# Altium project Purple_Pill.PrjPcb
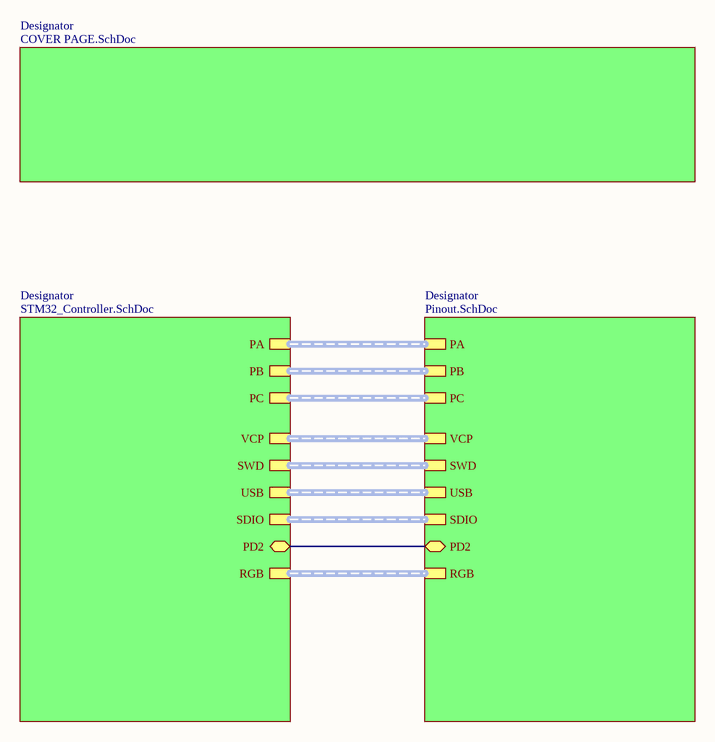
[diagram p0: Purple_Pill.SchDoc]
4 sheets, 64 parts. Net scope: hierarchical (ports join the sheet entries above them; power ports are global).
Board file: Purple_Pill.PcbDoc
Sheets:
  Purple_Pill.SchDoc
    Designator = STM32_Controller.SchDoc
    Designator = Pinout.SchDoc
    Designator = COVER PAGE.SchDoc

## Sheet Purple_Pill.SchDoc: =DocumentName
size 393 x 281 mm; Date: Do not fill; ApprovedBy: Do not fill; CheckedBy: Do not fill; CompanyName: STAR; DrawnBy: Do not fill; Engineer: Do not fill; Organization: STAR; Address1: Avenida Peseta 68, 1ºB; Address2: Madrid, Madrid 28054; Address3: +34603739927; Address4: contact.star@uc3m.es; DocumentNumber: Do not fill; SheetNumber: 1; SheetTotal: 4; Project Name: Purple Pill; Sheet Name: Purple Pill; Time: Do not fill; ImagePath: Do not fill; Application_BuildNumber: Do not fill

### Sub-sheets
Designator = STM32_Controller.SchDoc: PA (harness GPIO1), PB (harness GPIO2), PC (harness GPIO3), VCP (harness VCP), SWD (harness SWD), USB (harness USB), SDIO (harness SDIO), PD2 (bidir), RGB (harness RGB)
Designator = Pinout.SchDoc: PA (harness GPIO1), PB (harness GPIO2), PC (harness GPIO3), VCP (harness VCP), SWD (harness SWD), USB (harness USB), SDIO (harness SDIO), PD2 (bidir), RGB (harness RGB)
Designator = COVER PAGE.SchDoc: no entries

### Nets
PD2: sheet Designator/PD2, sheet Designator/PD2

### Notes on the sheet
- SHEET NAME
- FILE NAME
- A3
- SIZE
- PROJECT NAME
- AUTHOR
- SHEET
- OF
- REV

## Sheet STM32_Controller.SchDoc: =DocumentName
size 393 x 281 mm; Date: Do not fill; ApprovedBy: Do not fill; CheckedBy: Do not fill; CompanyName: STAR; DrawnBy: Do not fill; Engineer: Do not fill; Organization: STAR; Address1: Avenida Peseta 68, 1ºB; Address2: Madrid, Madrid 28054; Address3: +34603739927; Address4: contact.star@uc3m.es; DocumentNumber: Do not fill; SheetNumber: 3; SheetTotal: 4; Project Name: Purple Pill; Sheet Name: STM32 Controller; Time: Do not fill; ImagePath: Do not fill; Application_BuildNumber: Do not fill
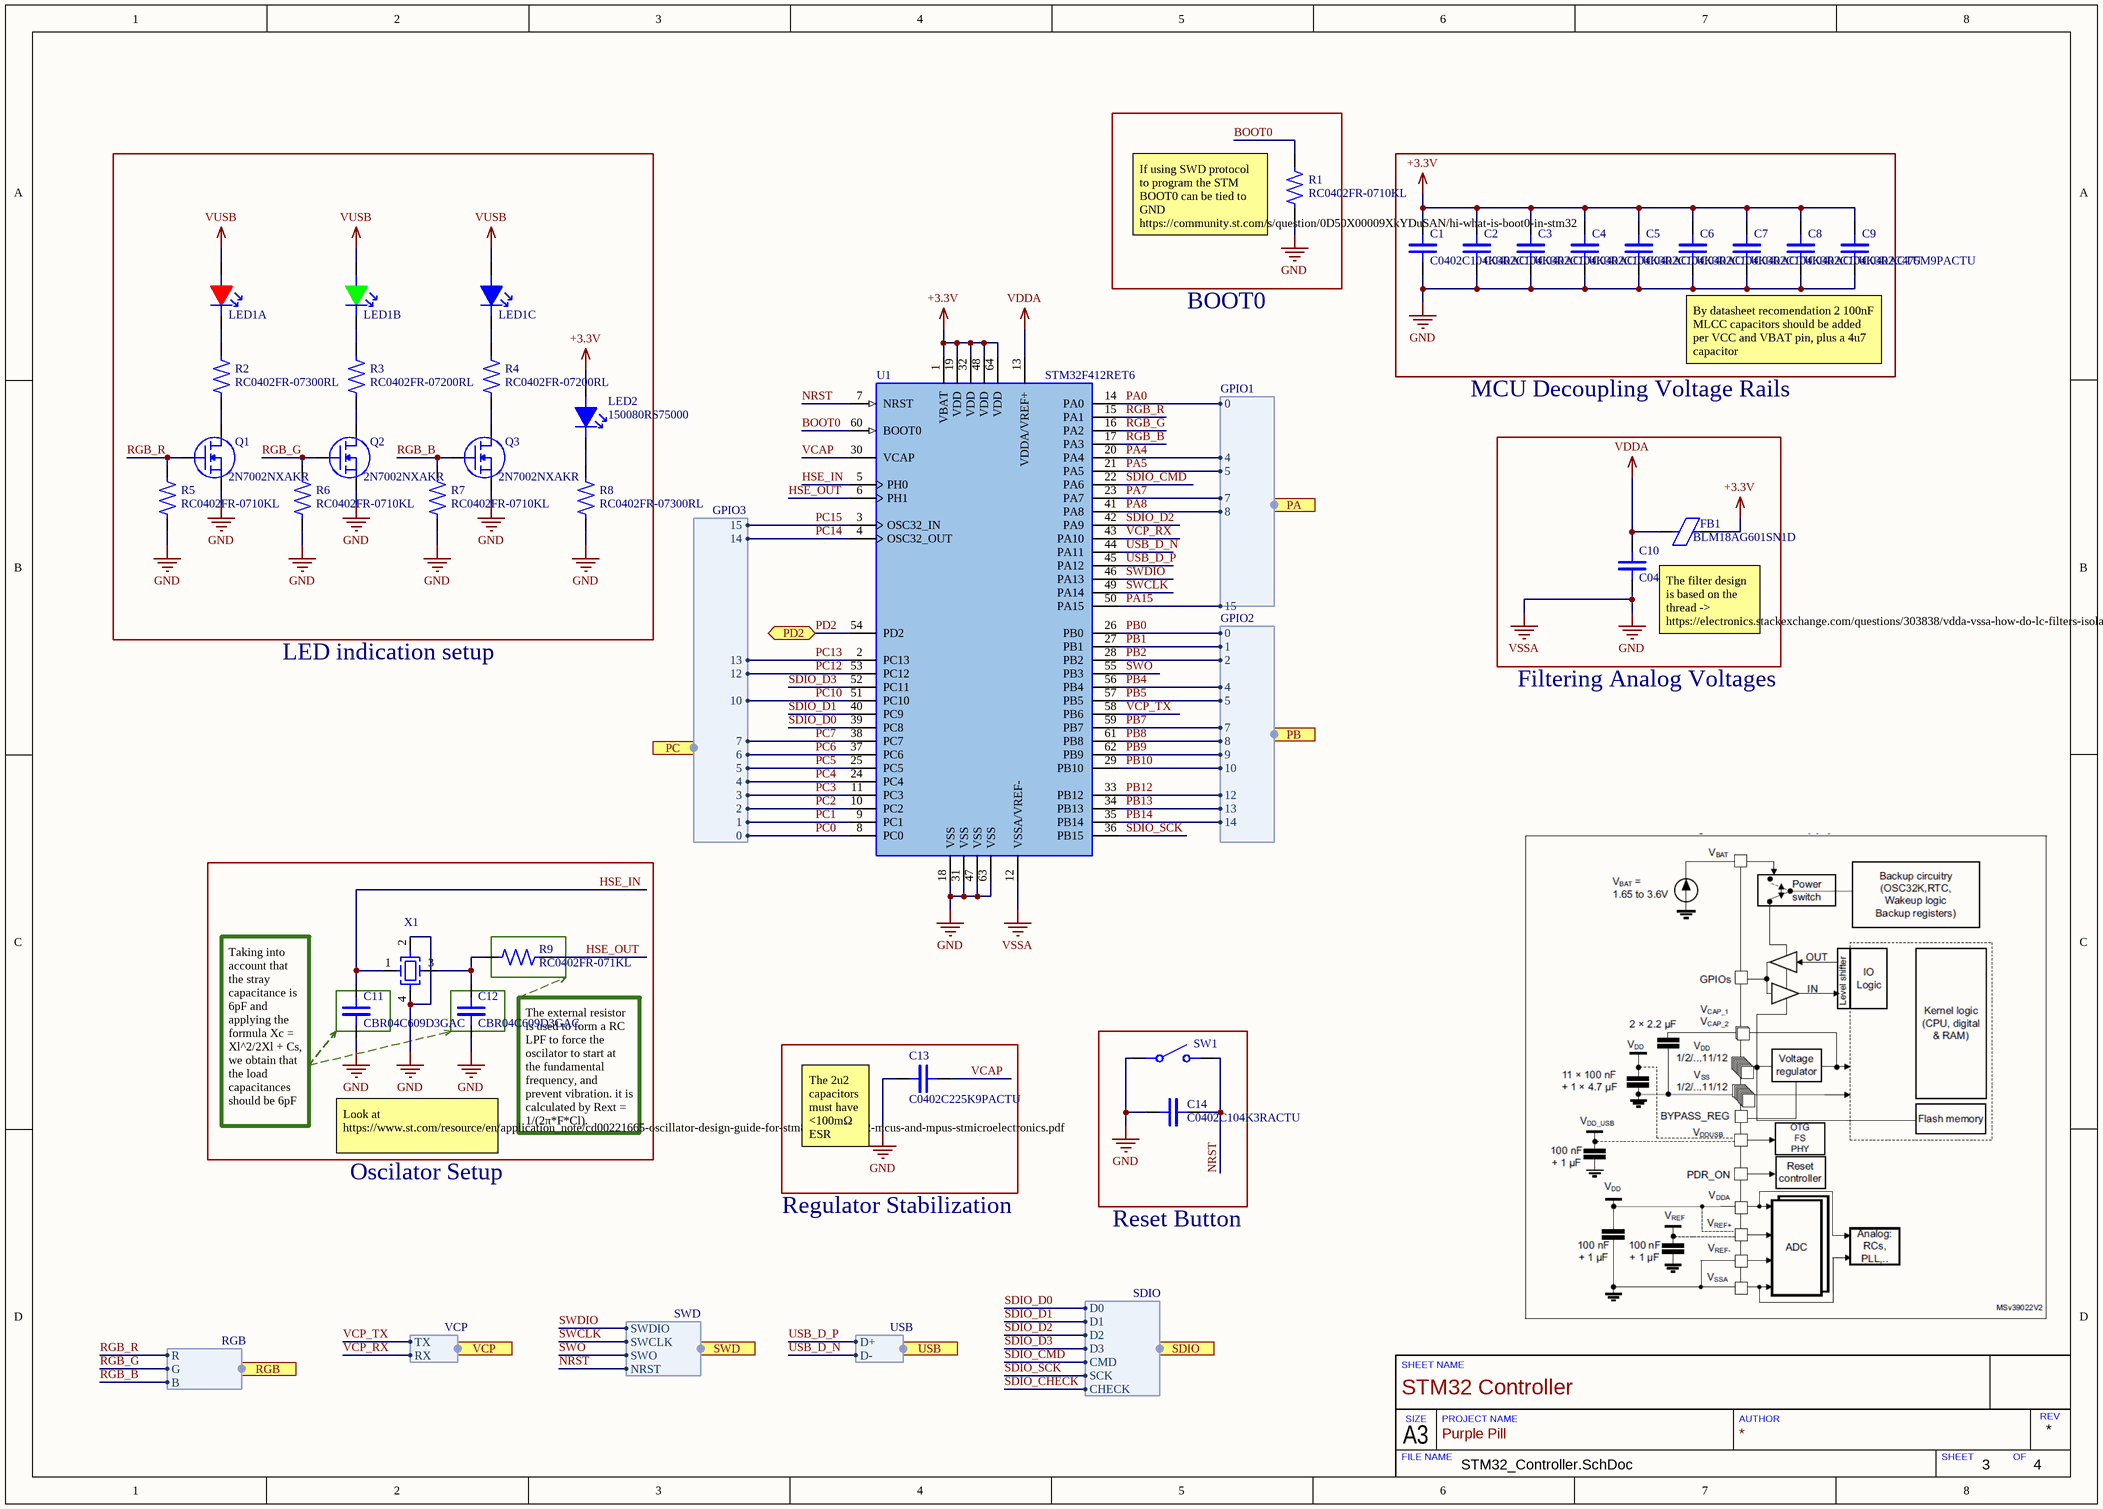
[diagram p1: STM32_Controller.SchDoc]

### Parts
C1  C0402C104K3RACTU  [CM0402_KEMET]
C2  C0402C104K3RACTU  [CM0402_KEMET]
C3  C0402C104K3RACTU  [CM0402_KEMET]
C4  C0402C104K3RACTU  [CM0402_KEMET]
C5  C0402C104K3RACTU  [CM0402_KEMET]
C6  C0402C104K3RACTU  [CM0402_KEMET]
C7  C0402C104K3RACTU  [CM0402_KEMET]
C8  C0402C104K3RACTU  [CM0402_KEMET]
C9  C0402C475M9PACTU  [CM0402_KEMET]
C10  C0402C104K3RACTU  [CM0402_KEMET]
C11  CBR04C609D3GAC  [CM0402_KEMET]
C12  CBR04C609D3GAC  [CM0402_KEMET]
C13  C0402C225K9PACTU  [CM0402_KEMET]
C14  C0402C104K3RACTU  [CM0402_KEMET]
FB1  BLM18AG601SN1D  [FB0603_MURATA]
LED1  TC5050RGBF08-3CJH-AF53A  [LED_RGB_5050]  (value not drawn)  (parts A,B,C of 3)
LED2  150080RS75000  [LED0805_WURTH]
Q1  2N7002NXAKR  [SOT23-3]
Q2  2N7002NXAKR  [SOT23-3]
Q3  2N7002NXAKR  [SOT23-3]
R1  RC0402FR-0710KL  [R0402_YAGEO]
R2  RC0402FR-07300RL  [R0402_YAGEO]
R3  RC0402FR-07200RL  [R0402_YAGEO]
R4  RC0402FR-07200RL  [R0402_YAGEO]
R5  RC0402FR-0710KL  [R0402_YAGEO]
R6  RC0402FR-0710KL  [R0402_YAGEO]
R7  RC0402FR-0710KL  [R0402_YAGEO]
R8  RC0402FR-07300RL  [R0402_YAGEO]
R9  RC0402FR-071KL  [R0402_YAGEO]
SW1  Push button SPST small  [1TS002E-2400-2500-CT]  (value not drawn)
U1  STM32F412RET6  [LQFP64]
X1  CR24MHz  [XTAL_3.2x2.4]  (value not drawn)

### Ports
PA (harness GPIO1), PB (harness GPIO2), PC (harness GPIO3), PD2 (bidir), RGB (harness RGB), SDIO (harness SDIO), SWD (harness SWD), USB (harness USB), VCP (harness VCP)

### Harnesses
GPIO2: 0, 5, 7, 8, 10, 12, 1, 13, 14, 2, 9, 4
GPIO1: 4, 8, 15, 5, 7, 0
GPIO3: 10, 7, 6, 5, 4, 3, 1, 0, 2, 12, 13, 15, 14
SWD: SWDIO, SWCLK, SWO, NRST
VCP: TX, RX
USB: D+, D-
SDIO: D3, CMD, SCK, CHECK, D2, D1, D0
RGB: R, G, B

### Nets
+3.3V: C1.2 C2.2 C3.2 C4.2 C5.2 C6.2 C7.2 C8.2 C9.2 FB1.2 LED2.2(Anode) U1.1(VBAT) U1.19(VDD) U1.32(VDD) U1.48(VDD) U1.64(VDD)
GND: C1.1 C2.1 C3.1 C4.1 C5.1 C6.1 C7.1 C8.1 C9.1 C10.1 C11.1 C12.1 C13.2 C14.1 Q1.3(Source) Q2.3(Source) Q3.3(Source) R1.1 R5.1 R6.1 R7.1 R8.1 SW1.2 U1.12(VSSA/VREF-) U1.18(VSS) U1.31(VSS) U1.47(VSS) U1.63(VSS) X1.2(Ground) X1.4(Ground)  [also labelled VSSA]
VDDA: C10.2 FB1.1 U1.13(VDDA/VREF+)
VUSB: LED1.1(Anode1) LED1.3(Anode2) LED1.5(Anode3)
BOOT0: R1.2 U1.60(BOOT0)
HSE_IN: C11.2 U1.5(PH0) X1.1(XTAL1)
HSE_OUT: R9.2 U1.6(PH1)
NRST: C14.2 SW1.1 U1.7(NRST) ; port SWD.NRST
PA0: U1.14(PA0) ; port PA.0
PA4: U1.20(PA4) ; port PA.4
PA5: U1.21(PA5) ; port PA.5
PA7: U1.23(PA7) ; port PA.7
PA8: U1.41(PA8) ; port PA.8
PA15: U1.50(PA15) ; port PA.15
PB0: U1.26(PB0) ; port PB.0
PB1: U1.27(PB1) ; port PB.1
PB2: U1.28(PB2) ; port PB.2
PB4: U1.56(PB4) ; port PB.4
PB5: U1.57(PB5) ; port PB.5
PB7: U1.59(PB7) ; port PB.7
PB8: U1.61(PB8) ; port PB.8
PB9: U1.62(PB9) ; port PB.9
PB10: U1.29(PB10) ; port PB.10
PB12: U1.33(PB12) ; port PB.12
PB13: U1.34(PB13) ; port PB.13
PB14: U1.35(PB14) ; port PB.14
PC0: U1.8(PC0) ; port PC.0
PC1: U1.9(PC1) ; port PC.1
PC2: U1.10(PC2) ; port PC.2
PC3: U1.11(PC3) ; port PC.3
PC4: U1.24(PC4) ; port PC.4
PC5: U1.25(PC5) ; port PC.5
PC6: U1.37(PC6) ; port PC.6
PC7: U1.38(PC7) ; port PC.7
PC10: U1.51(PC10) ; port PC.10
PC12: U1.53(PC12) ; port PC.12
PC13: U1.2(PC13) ; port PC.13
PC14: U1.4(OSC32_OUT) ; port PC.14
PC15: U1.3(OSC32_IN) ; port PC.15
PD2: U1.54(PD2) ; port PD2
RGB_B: Q3.1(Gate) R7.2 U1.17(PA3) ; port RGB.B
RGB_G: Q2.1(Gate) R6.2 U1.16(PA2) ; port RGB.G
RGB_R: Q1.1(Gate) R5.2 U1.15(PA1) ; port RGB.R
SDIO_CMD: U1.22(PA6) ; port SDIO.CMD
SDIO_D0: U1.39(PC8) ; port SDIO.D0
SDIO_D1: U1.40(PC9) ; port SDIO.D1
SDIO_D2: U1.42(PA9) ; port SDIO.D2
SDIO_D3: U1.52(PC11) ; port SDIO.D3
SDIO_SCK: U1.36(PB15) ; port SDIO.SCK
SWCLK: U1.49(PA14) ; port SWD.SWCLK
SWDIO: U1.46(PA13) ; port SWD.SWDIO
SWO: U1.55(PB3) ; port SWD.SWO
USB_D_N: U1.44(PA11) ; port USB.D-
USB_D_P: U1.45(PA12) ; port USB.D+
VCAP: C13.1 U1.30(VCAP)
VCP_RX: U1.43(PA10) ; port VCP.RX
VCP_TX: U1.58(PB6) ; port VCP.TX
NetC12_2: C12.2 R9.1 X1.3(XTAL2)
NetLED1_2: LED1.2(Cathode1) R2.2
NetLED1_4: LED1.4(Cathode2) R3.2
NetLED1_6: LED1.6(Cathode3) R4.2
NetLED2_1: LED2.1(Cathode) R8.2
NetQ1_2: Q1.2(Drain) R2.1
NetQ2_2: Q2.2(Drain) R3.1
NetQ3_2: Q3.2(Drain) R4.1

### Notes on the sheet
- (near R1) If using SWD protocol to program the STM BOOT0 can be tied to GND https://community.st.com/s/question/0D50X00009XkYDuSAN/hi-what-is-boot0-in-stm32
- BOOT0
- By datasheet recomendation 2 100nF MLCC capacitors should be added per VCC and VBAT pin, plus a 4u7 capacitor
- MCU Decoupling Voltage Rails
- The filter design is based on the thread -> https://electronics.stackexchange.com/questions/303838/vdda-vssa-how-do-lc-filters-isolate-the-input-pins-to-minimize-error-and-noi
- LED indication setup
- Filtering Analog Voltages
- Taking into account that the stray capacitance is 6pF and applying the formula Xc = Xl^2/2Xl + Cs, we obtain that the load capacitances should be 6pF
- The external resistor is used to form a RC LPF to force the oscilator to start at the fundamental frequency, and prevent vibration. it is calculated by Rext = 1/(2π*F*Cl).
- Look at https://www.st.com/resource/en/application_note/cd00221665-oscillator-design-guide-for-stm8af-al-s-stm32-mcus-and-mpus-stmicroelectronics.pdf
- Oscilator Setup
- (near C13) The 2u2 capacitors must have <100mΩ ESR
- Regulator Stabilization
- Reset Button
- RGB LED analog voltages
- Virtual COM port through ST-LINK
- SWD comunication protocol for debug and program
- USB D+ & D- differential signal
- Secure Digital Input Output, interface for SD cards
- SHEET NAME
- FILE NAME
- A3
- SIZE
- PROJECT NAME
- AUTHOR
- SHEET
- OF
- REV

### Library data of the parts
C1-C8 C10 C14 = CMP-CAP-002-00024-2: 0.1 µF ±10% 25V Ceramic Capacitor X7R 0402 (1005 Metric; Manufacturer: KEMET; Capacitance: 100nF; Unit weight: 1.5mg; Voltage rating: 25V; Component link: https://octopart.com/c0402c104k3ractu-kemet-71105629?r=sp; Height: 500µm; Mounting type: SMT; Maximun operating temperature: 125°C; Package: 0402; RoHS: Yes; Minimun operating temperature: -55°C; Dielectric: X7R; Tolerance: 10%; LCSC Part#: C1525
C9 = CMP-CAP-002-00026-2: 4.7 µF ±20% 6.3V Ceramic Capacitor X5R 0402 (1005 Metric); Manufacturer: KEMET; Unit weight: 1.5mg; Capacitance: 4.7µF; Tolerance: 10%; Dielectric: X5R; Maximun operating temperature: 85°C; Mounting type: SMT; Component link: https://octopart.com/search?q=C0402C475M9PACTU&currency=USD&specs=0; RoHS: Yes; Voltage rating: 6.3V; Height: 500µm; Package: 0402; Minimun operating temperature: -55°C; LCSC Part#: C368809
C11 C12 = CMP-CAP-002-00027-2: 6 pF ±0.5pF 25V Ceramic Capacitor C0G, NP0 0402 (1005 Metric); Manufacturer: KEMET; Unit weight: 1.5mg; Tolerance: 8.3%; Capacitance: 6pF; RoHS: Yes; Mounting type: SMT; Height: 500µm; Maximun operating temperature: 125°C; Voltage rating: 25V; Component link: https://octopart.com/cbr04c609d3gac-kemet-88381094?r=sp; Package: 0402; Dielectric: C0G; Minimun operating temperature: -55°C; LCSC Part#: C1575
C13 = CMP-CAP-002-00025-2: 2.2 µF ±10% 6.3V Ceramic Capacitor X5R 0402 (1005 Metric); Manufacturer: KEMET; Unit weight: 1.5mg; Capacitance: 2.2µF; Height: 500µm; Voltage rating: 6.3V; Mounting type: SMT; Component link: https://octopart.com/c0402c225k9pactu-kemet-46923142?r=sp; Minimun operating temperature: -55°C; RoHS: Yes; Tolerance: 10%; Maximun operating temperature: 125°C; Dielectric: X5R; Package: 0402; LCSC Part#: C77002
FB1 = CMP-IND-001-00000-2: Ferrite Chip, 1 Function(s), 0.5A, 2 Pin(s); Manufacturer: Murata; Maximun DC resistance: 0.38; Impedance: 600; Unit weight: 35mg; Test frequency: 100MHz; Tolerance: 25%; Maximun DC current: 500mA; RoHs: Yes; Height: 800µm; Maximun operating temperature: 125°C; Component link: https://octopart.com/blm18ag601sn1d-murata-42207?r=sp#PriceAndStock; Package: 0603; Mounting type: SMT; Minimun operating temperature: -55°C; LCSC Part#: C19330
LED1 = CMP-DIOD-001-00006-3: 20mA -40℃~+85℃ RGB 200mW 5050(mm) Light Emitting Diodes (LED) ROHS; pin to pad: 1>2 2>5 3>1 4>6 5>3 6>4; Manufacturer: TCWIN; Forward Voltages: R: 2.2V, G: 3V, B: 3V; Lens transparency: Silicone; MCD ratings: R: 700mcd, G: 1750mcd, B: 500mcd; Viewing angle: 60º; Colors/Wavelegths: R: 622, G: 517, B: 467; Nominal Currents: R: 20mA, G: ~20mA, B: ~20mA; Component link: https://octopart.com/tc5050rgbf08-3cjh-af53a-tcwin-122695383?r=sp; RoHS: Yes; Mounting type: SMT; Maximun operating temperature: 85°C; Package: 5050 (mm); Height: 1.6mm; Minimun operating temperature: -40°C; LCSC Part#: C784540
LED2 = CMP-DIOD-001-00002-3: Red 625nm LED Indication - Discrete 2V 0805 (2012 Metric); Manufacturer: Würth Elektronik; Unit weight: 25mg; Lens transparency: Clear; Viewing angle: 140º; MCD ratings: 150mcd; Nominal Currents: 20mA; Colors/Wavelegths: Red, 625nm; Minimun operating temperature: -40°C; Maximun operating temperature: 85°C; Forward Voltages: 2V; Mounting type: SMT; RoHS: Yes; Package: 0805; Height: 800µm; Component link: https://octopart.com/150080rs75000-w%C3%BCrth+elektronik-29717781?r=sp; LCSC Part#: C5137314
Q1-Q3 = CMP-TRAN-002-00009-3: 2N7002NXAK - 60 V, single N-channel Trench MOSFET; pin to pad: 2>3 3>2; Manufacturer: Nexperia; VoltageGS (th): 1.6V; V (DS) breakdown: 60V; gfs: 500m; Unit weight: 8mg; Channel Type: N; Rds (ON): 3; Power Dissipation: 325mW; I (d) Pulsed: 760mA; I (GS) leakage: 500nA; I (D) Continuous: 190mA; RoHs: Yes; Component link: https://octopart.com/2n7002nxakr-nexperia-103147780?r=sp; Mounting type: SMT; Minimun operating temperature: -55°C; Package: SOT23-3; Maximun operating temperature: 150°C; Height: 1.1mm; LCSC Part#: C350313
R1 R5-R7 = CMP-RES-000-00048-4: 10 kOhms ±1% 0.063W, 1/16W Chip Resistor 0402 (1005 Metric) Moisture Resistant Thick Film; Manufacturer: YAGEO; Temperature coefficient: 100PPM/Cº; Voltage rating: 50V; Resistance: 10k; Unit weight: 650µg; Power rating: 62.5mW; Mounting type: SMT; Maximun operating temperature: 155°C; Component link: https://octopart.com/rc0402fr-0710kl-yageo-55458461?r=sp; Tolerance: 1%; Minimun operating temperature: -55°C; Package: 0402; RoHS: Yes; Height: 350µm; LCSC Part#: C60490
R2 R8 = CMP-RES-000-00051-3: 300 Ohms ±1% 0.063W, 1/16W Chip Resistor 0402 (1005 Metric) Moisture Resistant Thick Film; Manufacturer: YAGEO; Power rating: 62.5mW; Temperature coefficient: 100; Resistance: 300; Voltage rating: 50V; Unit weight: 650µg; Component link: https://octopart.com/rc0402fr-07300rl-yageo-39798431?r=sp; Mounting type: SMT; Tolerance: 1%; Package: 0402; RoHS: Yes; Maximun operating temperature: 155°C; Minimun operating temperature: -55°C; Height: 350µm; LCSC Part#: C138010
R3 R4 = CMP-RES-000-00050-3: 200 Ohms ±1% 0.063W, 1/16W Chip Resistor 0402 (1005 Metric) Moisture Resistant Thick Film; Manufacturer: YAGEO; Voltage rating: 50V; Unit weight: 650µg; Resistance: 200; Temperature coefficient: 100; Power rating: 62.5mW; Mounting type: SMT; Minimun operating temperature: -55°C; Height: 350µm; Tolerance: 1%; Package: 0402; Maximun operating temperature: 155°C; RoHS: Yes; Component link: https://octopart.com/rc0402fr-07200rl-yageo-42471199?r=sp; LCSC Part#: C114764
R9 = CMP-RES-000-00053-2: 1 kOhms ±1% 0.063W, 1/16W Chip Resistor 0402 (1005 Metric) Moisture Resistant Thick Film; Manufacturer: YAGEO; Power rating: 62.5mW; Temperature coefficient: 100; Voltage rating: 50V; Resistance: 1k; Unit weight: 650µg; Maximun operating temperature: 155°C; Tolerance: 1%; Mounting type: SMT; Package: 0402; Minimun operating temperature: -55°C; Component link: https://octopart.com/rc0402fr-071kl-yageo-55402862?r=sp; RoHS: Yes; Height: 350µm; LCSC Part#: C106235
SW1 = CMP-SWI-000-00001-3: No NO Gull Wing 0.6W 50mA 6.1mm 100MΩ 30000 240gf@±50gf 12V -40℃~+90℃ 3.7mm 2.5mm Red Rectangle button Brick nogging SPST SMD,6.1x3.7x2.5mm Tactile Switches ROHS; Manufacturer: HYP; Equivalent resistance: 0.1; Package: 6.1mm x 3.7mm; Height: 2.5mm; RoHS: Yes; Maximun operating temperature: 90°C; Orientation: Up; Contact material: brass; Minimun operating temperature: -45°C; Steady state: NO; Throw configuration: SPST; Component link: https://octopart.com/1ts002e-2400-2500-ct-hongyuan+precision-99594626?r=sp; Type: Tactile switch; Mounting type: SMT; Voltage: 12V; LCSC Part#: C319365
U1 = CMP-ICS-003-00004-2: RISC Microcontroller, 32-Bit, FLASH, CORTEX-M4 CPU, 100MHz, CMOS, PQFP64; Manufacturer: STMicroelectronics; Core name/s: ARM -M4; DAC: None; Typical power rating.: 36mW; Minimun supply voltage: 1.7V; Core bit size: 32; RAM size: 256k; Flash/SDRAM size: 512k; Maximun supply voltage: 3.6V; Unit weight: 360mg; ADC: 16x12; I/O pins: 46; I/O voltages: 3.3V; Core count: 1; Interfaces: SPI, I2C, USART, SDIO, USB, CAN; Maximun operating temperature: 125; RoHS: Yes; Height: 1.6mm; Mounting type: SMT; Frequency: 100MHz; Package: LQFP64; Component link: https://octopart.com/stm32f412ret6-stmicroelectronics-75302708; Minimun operating temperature: -40°C; LCSC Part#: C89374
X1 = CMP-003-00032-9: Crystal Oscillator 24MHz 9pF +/-10ppm +/-20ppm; ESR: 40; Drive Level: 200 uW; Brand: ECS; Frequency Stability: 20 PPM; Tolerance: 10 PPM; Width: 2.5 mm; Maximum Operating Temperature: + 105 C; Packaging: Cut Tape; Series: ECS-33B; RoHS: Yes; Product: Crystals; Mounting Style: SMD/SMT; Load Capacitance: 9pF; Type: Miniature Crystal; Termination Style: SMD/SMT; Manufacturer: ECS; Height: 0.8 mm; Package/Case: SMD-4; Frequency: 24MHz; Product Category: Crystals; Length: 3.2 mm; Minimum Operating Temperature: - 40 C; ComponentLink1URL: https://www.mouser.es/datasheet/2/122/ECS_33B-1649459.pdf; ComponentLink1Description: Datasheet; LCSC Part#: C90910

## Sheet Pinout.SchDoc: =DocumentName
size 393 x 281 mm; Date: Do not fill; ApprovedBy: Do not fill; CheckedBy: Do not fill; CompanyName: STAR; DrawnBy: Do not fill; Engineer: Do not fill; Organization: STAR; Address1: Avenida Peseta 68, 1ºB; Address2: Madrid, Madrid 28054; Address3: +34603739927; Address4: contact.star@uc3m.es; DocumentNumber: Do not fill; SheetNumber: 4; SheetTotal: 4; Project Name: Purple Pill; Sheet Name: Pinout; Time: Do not fill; ImagePath: Do not fill; Application_BuildNumber: Do not fill
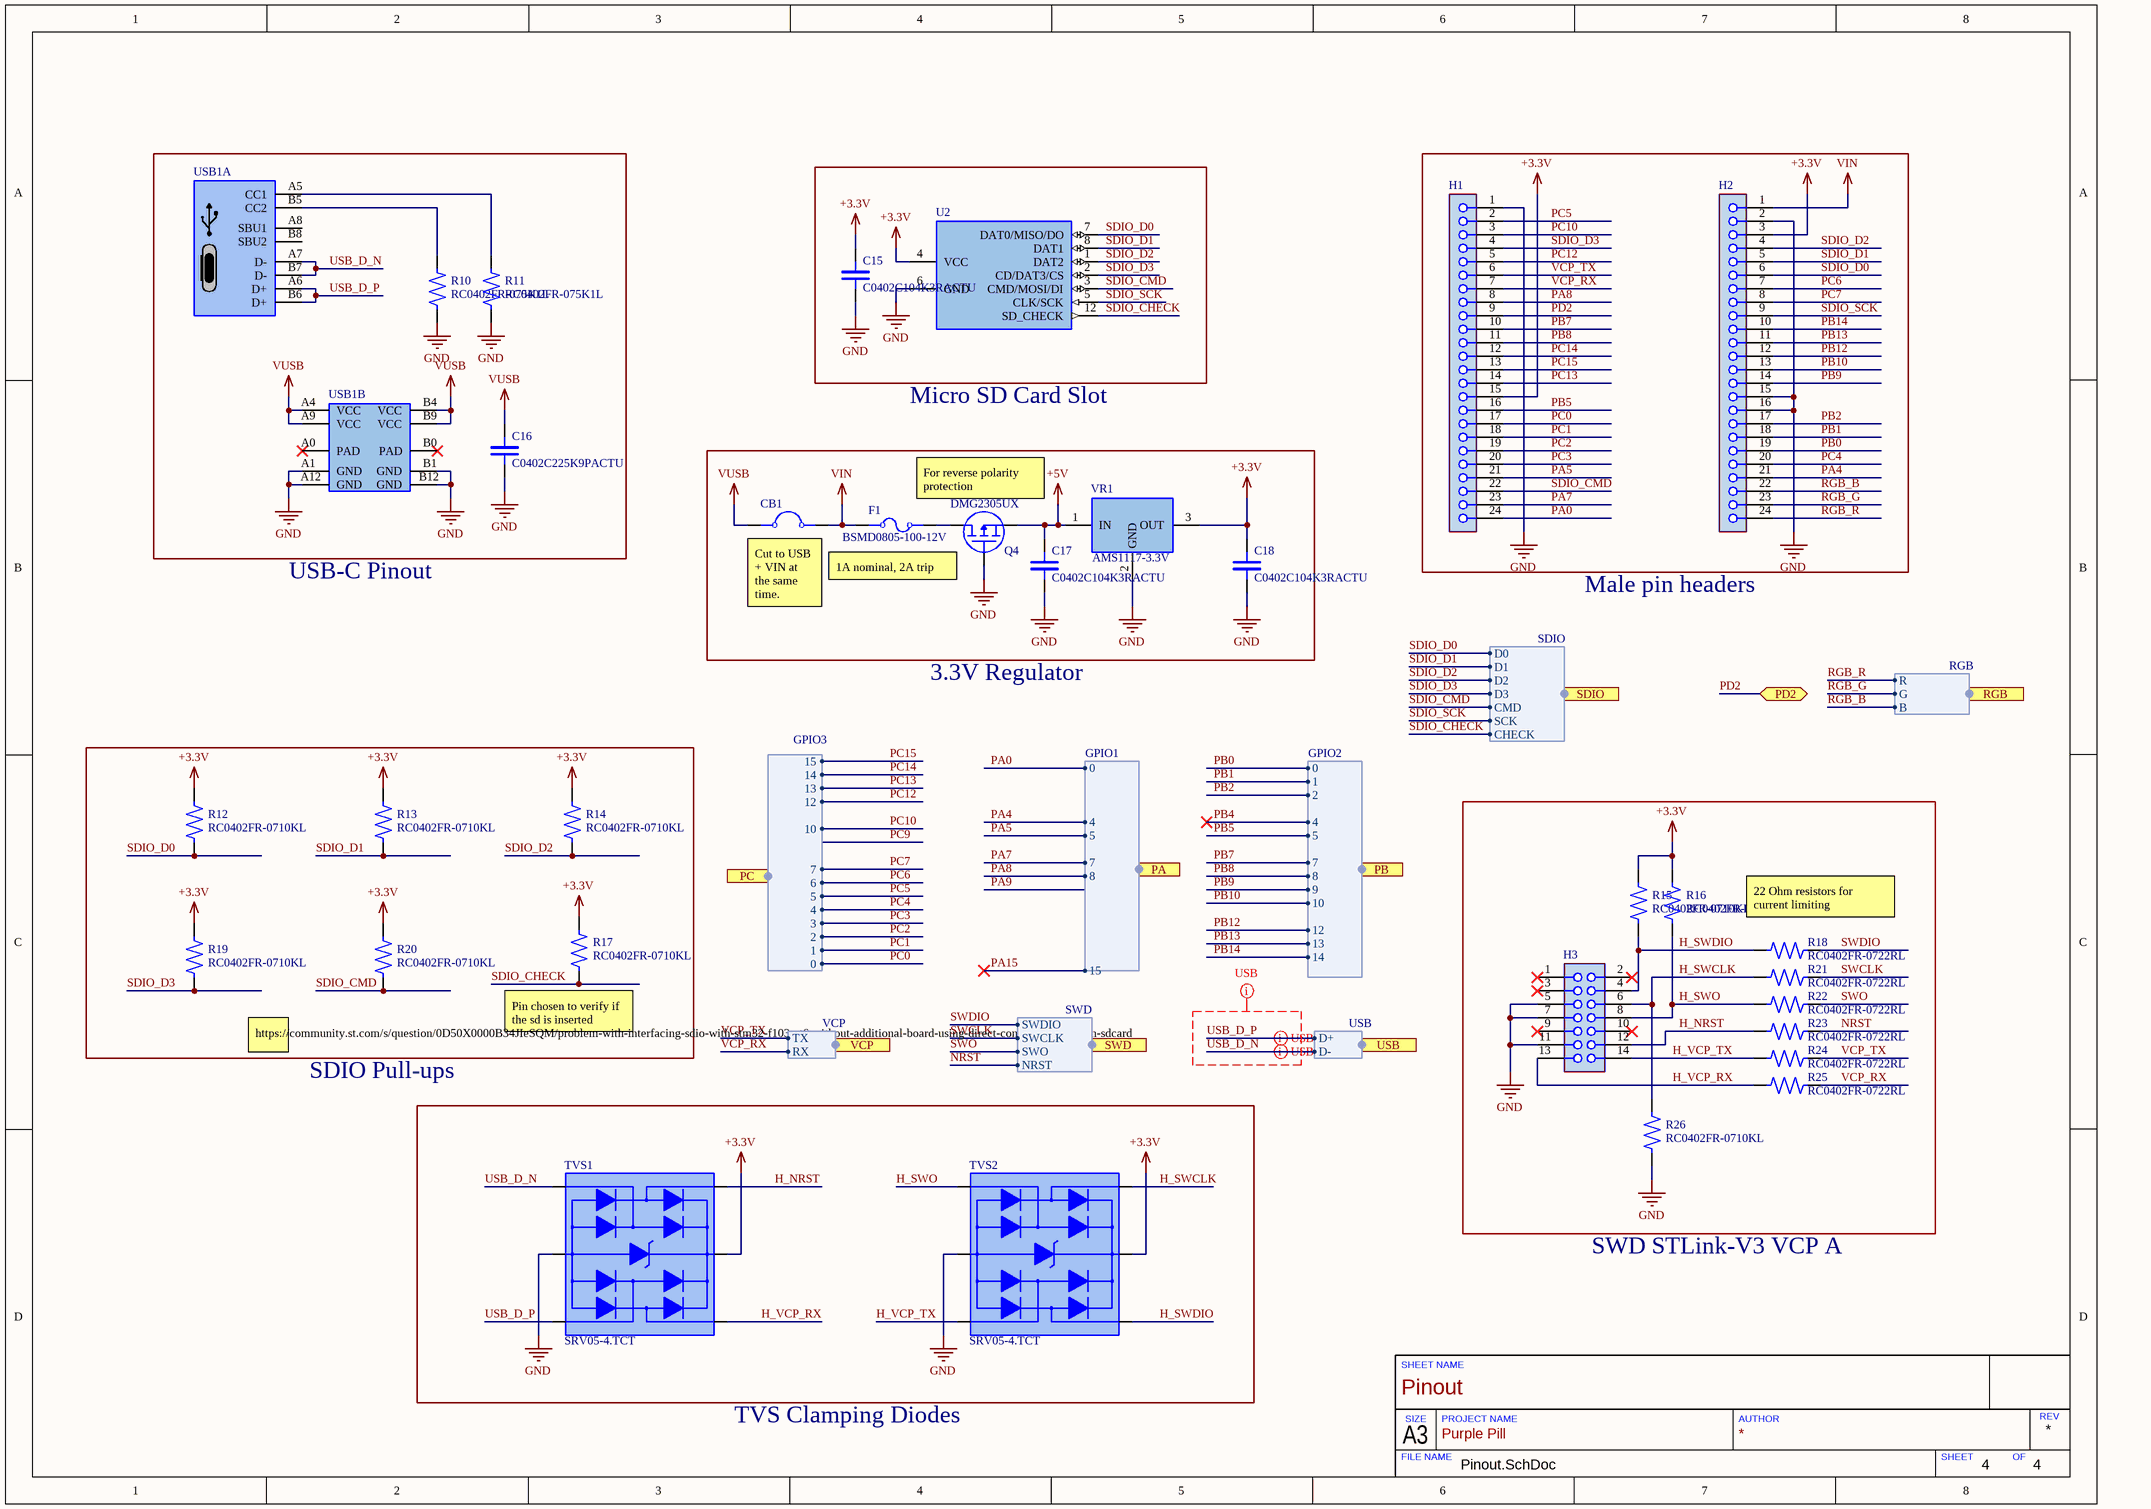
[diagram p2: Pinout.SchDoc]

### Parts
C15  C0402C104K3RACTU  [CM0402_KEMET]
C16  C0402C225K9PACTU  [CM0402_KEMET]
C17  C0402C104K3RACTU  [CM0402_KEMET]
C18  C0402C104K3RACTU  [CM0402_KEMET]
CB1  NC_JumperCircular  [NC_CircleJumper]  (value not drawn)
F1  BSMD0805-100-12V  [PTC0805]
H1  1x24MaleStraight_2.54  [1x24-Male-Straight-Pin_Header]  (value not drawn)
H2  1x24MaleStraight_2.54  [1x24-Male-Straight-Pin_Header]  (value not drawn)
H3  2x07MaleStraight_1.27  [2x07-Male-Straight-Pin_Header_1.27]  (value not drawn)
Q4  DMG2305UX  [SOT23-3]
R10  RC0402FR-075K1L  [R0402_YAGEO]
R11  RC0402FR-075K1L  [R0402_YAGEO]
R12  RC0402FR-0710KL  [R0402_YAGEO]
R13  RC0402FR-0710KL  [R0402_YAGEO]
R14  RC0402FR-0710KL  [R0402_YAGEO]
R15  RC0402FR-0710KL  [R0402_YAGEO]
R16  RC0402FR-0710KL  [R0402_YAGEO]
R17  RC0402FR-0710KL  [R0402_YAGEO]
R18  RC0402FR-0722RL  [R0402_YAGEO]
R19  RC0402FR-0710KL  [R0402_YAGEO]
R20  RC0402FR-0710KL  [R0402_YAGEO]
R21  RC0402FR-0722RL  [R0402_YAGEO]
R22  RC0402FR-0722RL  [R0402_YAGEO]
R23  RC0402FR-0722RL  [R0402_YAGEO]
R24  RC0402FR-0722RL  [R0402_YAGEO]
R25  RC0402FR-0722RL  [R0402_YAGEO]
R26  RC0402FR-0710KL  [R0402_YAGEO]
TVS1  SRV05-4.TCT  [SOT23-6]
TVS2  SRV05-4.TCT  [SOT23-6]
U2  104031-0811  [SMD_MicroSD]  (value not drawn)
USB1  USB4105-GF-A  [USB-C horizontal smd]  (value not drawn)  (parts A,B of 2)
VR1  AMS1117-3.3V  [SOT89]

### Ports
PA (harness GPIO1), PB (harness GPIO2), PC (harness GPIO3), PD2 (bidir), RGB (harness RGB), SDIO (harness SDIO), SWD (harness SWD), USB (harness USB), VCP (harness VCP)

### Harnesses
SWD: SWDIO, SWCLK, SWO, NRST
VCP: TX, RX
GPIO3: 10, 7, 6, 5, 4, 3, 1, 0, 2, 12, 13, 14, 15
GPIO2: 0, 5, 7, 8, 10, 12, 1, 13, 14, 2, 9, 4
GPIO1: 4, 8, 15, 5, 7, 0
USB: D+, D-
SDIO: D3, CMD, SCK, CHECK, D2, D1, D0
RGB: R, G, B

### Nets
+3.3V: C15.2 C18.2 H1.15 H2.3 R12.2 R13.2 R14.2 R15.2 R16.2 R17.2 R19.2 R20.2 TVS1.5(Gnd) TVS2.5(Gnd) U2.4(VCC) VR1.3(OUT)
+5V: C17.2 Q4.2(Source) VR1.1(IN)
GND: C15.1 C16.1 C17.1 C18.1 H1.1 H2.2 H2.15 H2.16 H3.5 H3.7 H3.11 Q4.1(Gate) R10.1 R11.1 R26.1 TVS1.2(VCC) TVS2.2(VCC) U2.6(GND) USB1.A1(GND) USB1.A12(GND) USB1.B1(GND) USB1.B12(GND) VR1.2(GND)
VIN: CB1.2 F1.1 H2.1
VUSB: C16.2 CB1.1 USB1.A4(VCC) USB1.A9(VCC) USB1.B4(VCC) USB1.B9(VCC)
H_NRST: H3.12 R23.2 TVS1.6(TVS1)
H_SWCLK: H3.6 R21.2 R26.2 TVS2.6(TVS1)
H_SWDIO: H3.4 R15.1 R18.2 TVS2.4(TVS4)
H_SWO: H3.8 R16.1 R22.2 TVS2.1(TVS2)
H_VCP_RX: H3.13 R25.2 TVS1.4(TVS4)
H_VCP_TX: H3.14 R24.2 TVS2.3(TVS3)
NRST: R23.1 ; port SWD.NRST
PA0: H1.24 ; port PA.0
PA4: H2.21 ; port PA.4
PA5: H1.21 ; port PA.5
PA7: H1.23 ; port PA.7
PA8: H1.8 ; port PA.8
PB0: H2.19 ; port PB.0
PB1: H2.18 ; port PB.1
PB2: H2.17 ; port PB.2
PB5: H1.16 ; port PB.5
PB7: H1.10 ; port PB.7
PB8: H1.11 ; port PB.8
PB9: H2.14 ; port PB.9
PB10: H2.13 ; port PB.10
PB12: H2.12 ; port PB.12
PB13: H2.11 ; port PB.13
PB14: H2.10 ; port PB.14
PC0: H1.17 ; port PC.0
PC1: H1.18 ; port PC.1
PC2: H1.19 ; port PC.2
PC3: H1.20 ; port PC.3
PC4: H2.20 ; port PC.4
PC5: H1.2 ; port PC.5
PC6: H2.7 ; port PC.6
PC7: H2.8 ; port PC.7
PC10: H1.3 ; port PC.10
PC12: H1.5 ; port PC.12
PC13: H1.14 ; port PC.13
PC14: H1.12 ; port PC.14
PC15: H1.13 ; port PC.15
PD2: H1.9 ; port PD2
RGB_B: H2.22 ; port RGB.B
RGB_G: H2.23 ; port RGB.G
RGB_R: H2.24 ; port RGB.R
SDIO_CHECK: R17.1 U2.12(SD_CHECK) ; port SDIO.CHECK
SDIO_CMD: H1.22 R20.1 U2.3(CMD/MOSI/DI) ; port SDIO.CMD
SDIO_D0: H2.6 R12.1 U2.7(DAT0/MISO/DO) ; port SDIO.D0
SDIO_D1: H2.5 R13.1 U2.8(DAT1) ; port SDIO.D1
SDIO_D2: H2.4 R14.1 U2.1(DAT2) ; port SDIO.D2
SDIO_D3: H1.4 R19.1 U2.2(CD/DAT3/CS) ; port SDIO.D3
SDIO_SCK: H2.9 U2.5(CLK/SCK) ; port SDIO.SCK
SWCLK: R21.1 ; port SWD.SWCLK
SWDIO: R18.1 ; port SWD.SWDIO
SWO: R22.1 ; port SWD.SWO
USB_D_N: TVS1.1(TVS2) USB1.A7(D-) USB1.B7(D-) ; port USB.D-
USB_D_P: TVS1.3(TVS3) USB1.A6(D+) USB1.B6(D+) ; port USB.D+
VCP_RX: H1.7 R25.1 ; port VCP.RX
VCP_TX: H1.6 R24.1 ; port VCP.TX
NetF1_2: F1.2 Q4.3(Drain)
NetR10_2: R10.2 USB1.B5(CC2)
NetR11_2: R11.2 USB1.A5(CC1)

Not connected (* = marked no-connect by the designer): H3 1* 2* 3* 9* 10*; USB1 A0(PAD)* A8(SBU1) B0(PAD)* B8(SBU2)

### Layout directives
differential pair: USB_D_N, USB_D_P
rule Undefined; rule Matched Net Lengths [Tolerance = 0.2mm]; rule Impedance Constraint [Min = 85.00    Max = 95.00    ]: USB_D_N, USB_D_P

### Notes on the sheet
- Micro SD Card Slot
- For reverse polarity protection
- USB-C Pinout
- (near Q4) 1A nominal, 2A trip
- (near CB1) Cut to USB + VIN at the same time.
- Male pin headers
- 3.3V Regulator
- RGB LED analog voltages
- Secure Digital Input Output, interface for SD cards
- (near R18) 22 Ohm resistors for current limiting
- https://community.st.com/s/question/0D50X0000B34JIeSQM/problem-with-interfacing-sdio-with-stm32-f103ret6-without-additional-board-using-direct-connection-to-9-pin-sdcard
- (near R17) Pin chosen to verify if the sd is inserted
- SDIO Pull-ups
- Virtual COM port through ST-LINK
- SWD comunication protocol for debug and program
- (near H3) USB D+ & D- differential signal
- SWD STLink-V3 VCP A
- TVS Clamping Diodes
- SHEET NAME
- FILE NAME
- A3
- SIZE
- PROJECT NAME
- AUTHOR
- SHEET
- OF
- REV

### Library data of the parts
C15 C17 C18 = CMP-CAP-002-00024-2: as C1 on sheet STM32_Controller; Voltage rating: 25V; Component link: https://octopart.com/c0402c104k3ractu-kemet-71105629?r=sp; Height: 500µm; Mounting type: SMT; Maximun operating temperature: 125°C; Package: 0402; RoHS: Yes; Minimun operating temperature: -55°C; Dielectric: X7R; Tolerance: 10%; LCSC Part#: C1525
C16 = CMP-CAP-002-00025-2: as C13 on sheet STM32_Controller; Height: 500µm; Voltage rating: 6.3V; Mounting type: SMT; Component link: https://octopart.com/c0402c225k9pactu-kemet-46923142?r=sp; Minimun operating temperature: -55°C; RoHS: Yes; Tolerance: 10%; Maximun operating temperature: 125°C; Dielectric: X5R; Package: 0402; LCSC Part#: C77002
CB1 = CMP-00030-00003-1: Jumper normally closed circular circuit breakers
F1 = CMP-FUS-000-00004-2: 12V 1A 40A 500mW -40℃~+85℃ 2A 40mΩ 300ms 270mΩ 0805 Resettable Fuses ROHS; Manufacturer: BHFUSE; Equivalent resistence: 20m; Maximun time to trip: 10s; Resetteable: Yes; Mounting type: SMT; Current rating: 1A; RoHS: Yes; Maximun operating temperature: 85°C; Current trip: 2A; Component link: https://octopart.com/bsmd0805-100-12v-bhfuse-122321729?r=sp; Maximun current hold: 40A; Package: 0805; Voltage rating: 12V; Minimun operating temperature: -40°C; LCSC Part#: C910823
H1 H2 = CMP-CONN-000-00022-1: Connector Header Through Hole 24 position 1 row 0.100" (2.54mm); Manufacturer: Variable; Voltage rating: 1.5kV; Current rating: 3A; Shielding: No; Connector type: Male Pin; Gender: Male; Contact finish: Bronze; Mounting type: SMT; Minimun operating temperature: -25°C; Number of pins: 24; RoHs: Yes; Component link: Variable; Maximun operating temperature: 105°C
H3 = CMP-002-00083-3: Connector Header Through Hole 14 position 2 rows 0.050" (1.27mm); Max Current Rating: 1.75A; Number of Contacts: 14; Gender: Male; Contact Material: Bronze; Length: 8.89mm; Max Operating Temperature: 125°C; Termination: Solder; Housing Color: Black; Depth: 3.43mm; Housing Material: Polymer; Number of Rows: 2; Min Operating Temperature: -55°C; Contact Plating: Gold; Orientation: Straight; Pitch: 1.27mm; Packaging: Rail/Tube
Q4 = CMP-TRAN-002-00012-2: Power Field-Effect Transistor, 4.2A I(D), 20V, 0.052ohm, 1-Element, P-Channel, Silicon, Metal-oxide Semiconductor FET; Manufacturer: Diodes Incorporated; Unit weight: 8mg; V (DS) breakdown: -20V; Rds (ON): 70m; VoltageGS (th): -700mV; Power Dissipation: 1.4W; Channel Type: P; I (GS) leakage: 100nA; I (d) Pulsed: 10A; I (D) Continuous: 4.2A; Package: SOT23-3; Mounting type: SMT; Maximun operating temperature: 150°C; Component link: https://octopart.com/dmg2305ux-13-diodes+inc.-29925594?r=sp; RoHs: Yes; Minimun operating temperature: -55°C; LCSC Part#: C2940629
R10 R11 = CMP-RES-000-00049-3: 5.1 kOhms ±1% 0.063W, 1/16W Chip Resistor 0402 (1005 Metric) Moisture Resistant Thick Film; Manufacturer: YAGEO; Resistance: 5.1k; Temperature coefficient: 100; Power rating: 62.5mW; Unit weight: 650µg; Voltage rating: 50V; Package: 0402; Tolerance: 1%; Mounting type: SMT; Height: 350mm; Maximun operating temperature: 155°C; Component link: https://octopart.com/rc0402fr-075k1l-yageo-39844409?r=sp; Minimun operating temperature: -55°C; RoHS: Yes; LCSC Part#: C105872
R12-R17 R19 R20 R26 = CMP-RES-000-00048-4: as R1 on sheet STM32_Controller; Mounting type: SMT; Maximun operating temperature: 155°C; Component link: https://octopart.com/rc0402fr-0710kl-yageo-55458461?r=sp; Tolerance: 1%; Minimun operating temperature: -55°C; Package: 0402; RoHS: Yes; Height: 350µm; LCSC Part#: C60490
R18 R21-R25 = CMP-RES-000-00052-2: 22 Ohms ±1% 0.063W, 1/16W Chip Resistor 0402 (1005 Metric) Moisture Resistant Thick Film; Manufacturer: YAGEO; Voltage rating: 50V; Temperature coefficient: 100; Unit weight: 650µg; Resistance: 22; Power rating: 62.5mW; Height: 350µm; Component link: https://octopart.com/rc0402fr-0722rl-yageo-40815132?r=sp; RoHS: Yes; Tolerance: 1%; Maximun operating temperature: 155°C; Mounting type: SMT; Minimun operating temperature: -55°C; Package: 0402; LCSC Part#: C114765
TVS1 TVS2 = CMP-DIOD-004-00005-3: Trans Voltage Suppressor Diode, 300W, 5V V(RWM), Unidirectional, 1 Element, Silicon; Manufacturer: Semtech; Breakdown Voltage: 15kV; Diodes Type: Zener and PN; Diode Configuration: Series; Peak Fordward Current: 30A; Junction Capacitance: 3pF; Package: SOT23-6; RoHS: YES; Component Link: https://octopart.com/srv05-4.tct-semtech-587280?r=sp; Mounting Style: SMT; Maximun operating temperature: 125°C; Minimun operating temperature: -25°C; LCSC Part#: C13612
U2 = CMP-CONN-000-00001-8: Micro SD receptacle. Position Card Connector Secure Digital - microSD™ Surface Mount, Right Angle Gold; pin to pad: 6>6+9+10+11+13+14; Manufacturer: Molex; Shielding: Yes; Contact finish: Gold; Component link: https://octopart.com/104031-0811-molex-18195782?r=sp; Connector type: Micro SD; RoHs: Yes; Mounting type: SMT; Number of pins: 9; Height: 1.42m; Gender: Receptacle; LCSC Part#: C585350
USB1 = CMP-CONN-000-00011-10: USB Connectors USB Type C,2.0, Rec,SMT, 0.95mmTH Shell Stakes,G/F,RA,Top Mnt,T&R; Manufacturer: GCT; Shielding: Yes; Voltage rating: 20V; Gender: Female; Unit weight: 768mg; Current rating: 5A; Mounting type: SMT; Minimun operating temperature: -40°C; Contact finish: Copper Alloy; RoHs: Yes; Maximun operating temperature: 85°C; Connector type: USB; Component link: https://octopart.com/usb4105-gf-a-global+connector+technology-107467269?r=sp; Number of pins: 16; Height: 3.31mm; LCSC Part#: C165948
VR1 = CMP-ICS-108-00011-2: 1A 12mA 1.4V@(1A) 0℃~+125℃ Fixed 3.3V~3.3V Positive 1 18V SOT-89 Linear Voltage Regulators (LDO) ROHS; pin to pad: 1>3 2>1 3>2; Manufacturer: MSKSEMI; Dropout voltage: 1.4V; Max output voltage: 3.3V; Accuracy: 1.8%; Number of regulators: 1; Minimun operating temperature: -65°C; Max input voltage: 18V; Max output current: 1A; Component link: https://octopart.com/ams1117-3.3v-wpmtek-122323140?r=sp; LDO theory link: https://bit.ly/3hQmsKW; Mounting type: SMT; Height: 1.6mm; Maximun operating temperature: 150°C; Min/fixed output voltage: 3.3V; Quiescent current: 12mA; Package: SOT-89; Type output voltage: Fixed; RoHS: Yes; LCSC Part#: C5120796

## Sheet COVER PAGE.SchDoc: Do not fill
size 393 x 281 mm; Date: Do not fill; CompanyName: STAR; DrawnBy: Do not fill; Engineer: Do not fill; Organization: STAR; Address1: Avenida Peseta 68, 1ºB; Address2: Madrid, Madrid 28054; Address3: +34603739927; Address4: contact.star@uc3m.es; DocumentNumber: Do not fill; SheetNumber: 1; SheetTotal: 3; Project Name: Purple Pill; Sheet Name: Cover Page; Web Page: STARuc3m.com; DateStarted: 20/11/2022; Time: Do not fill; ImagePath: Do not fill; Application_BuildNumber: Do not fill
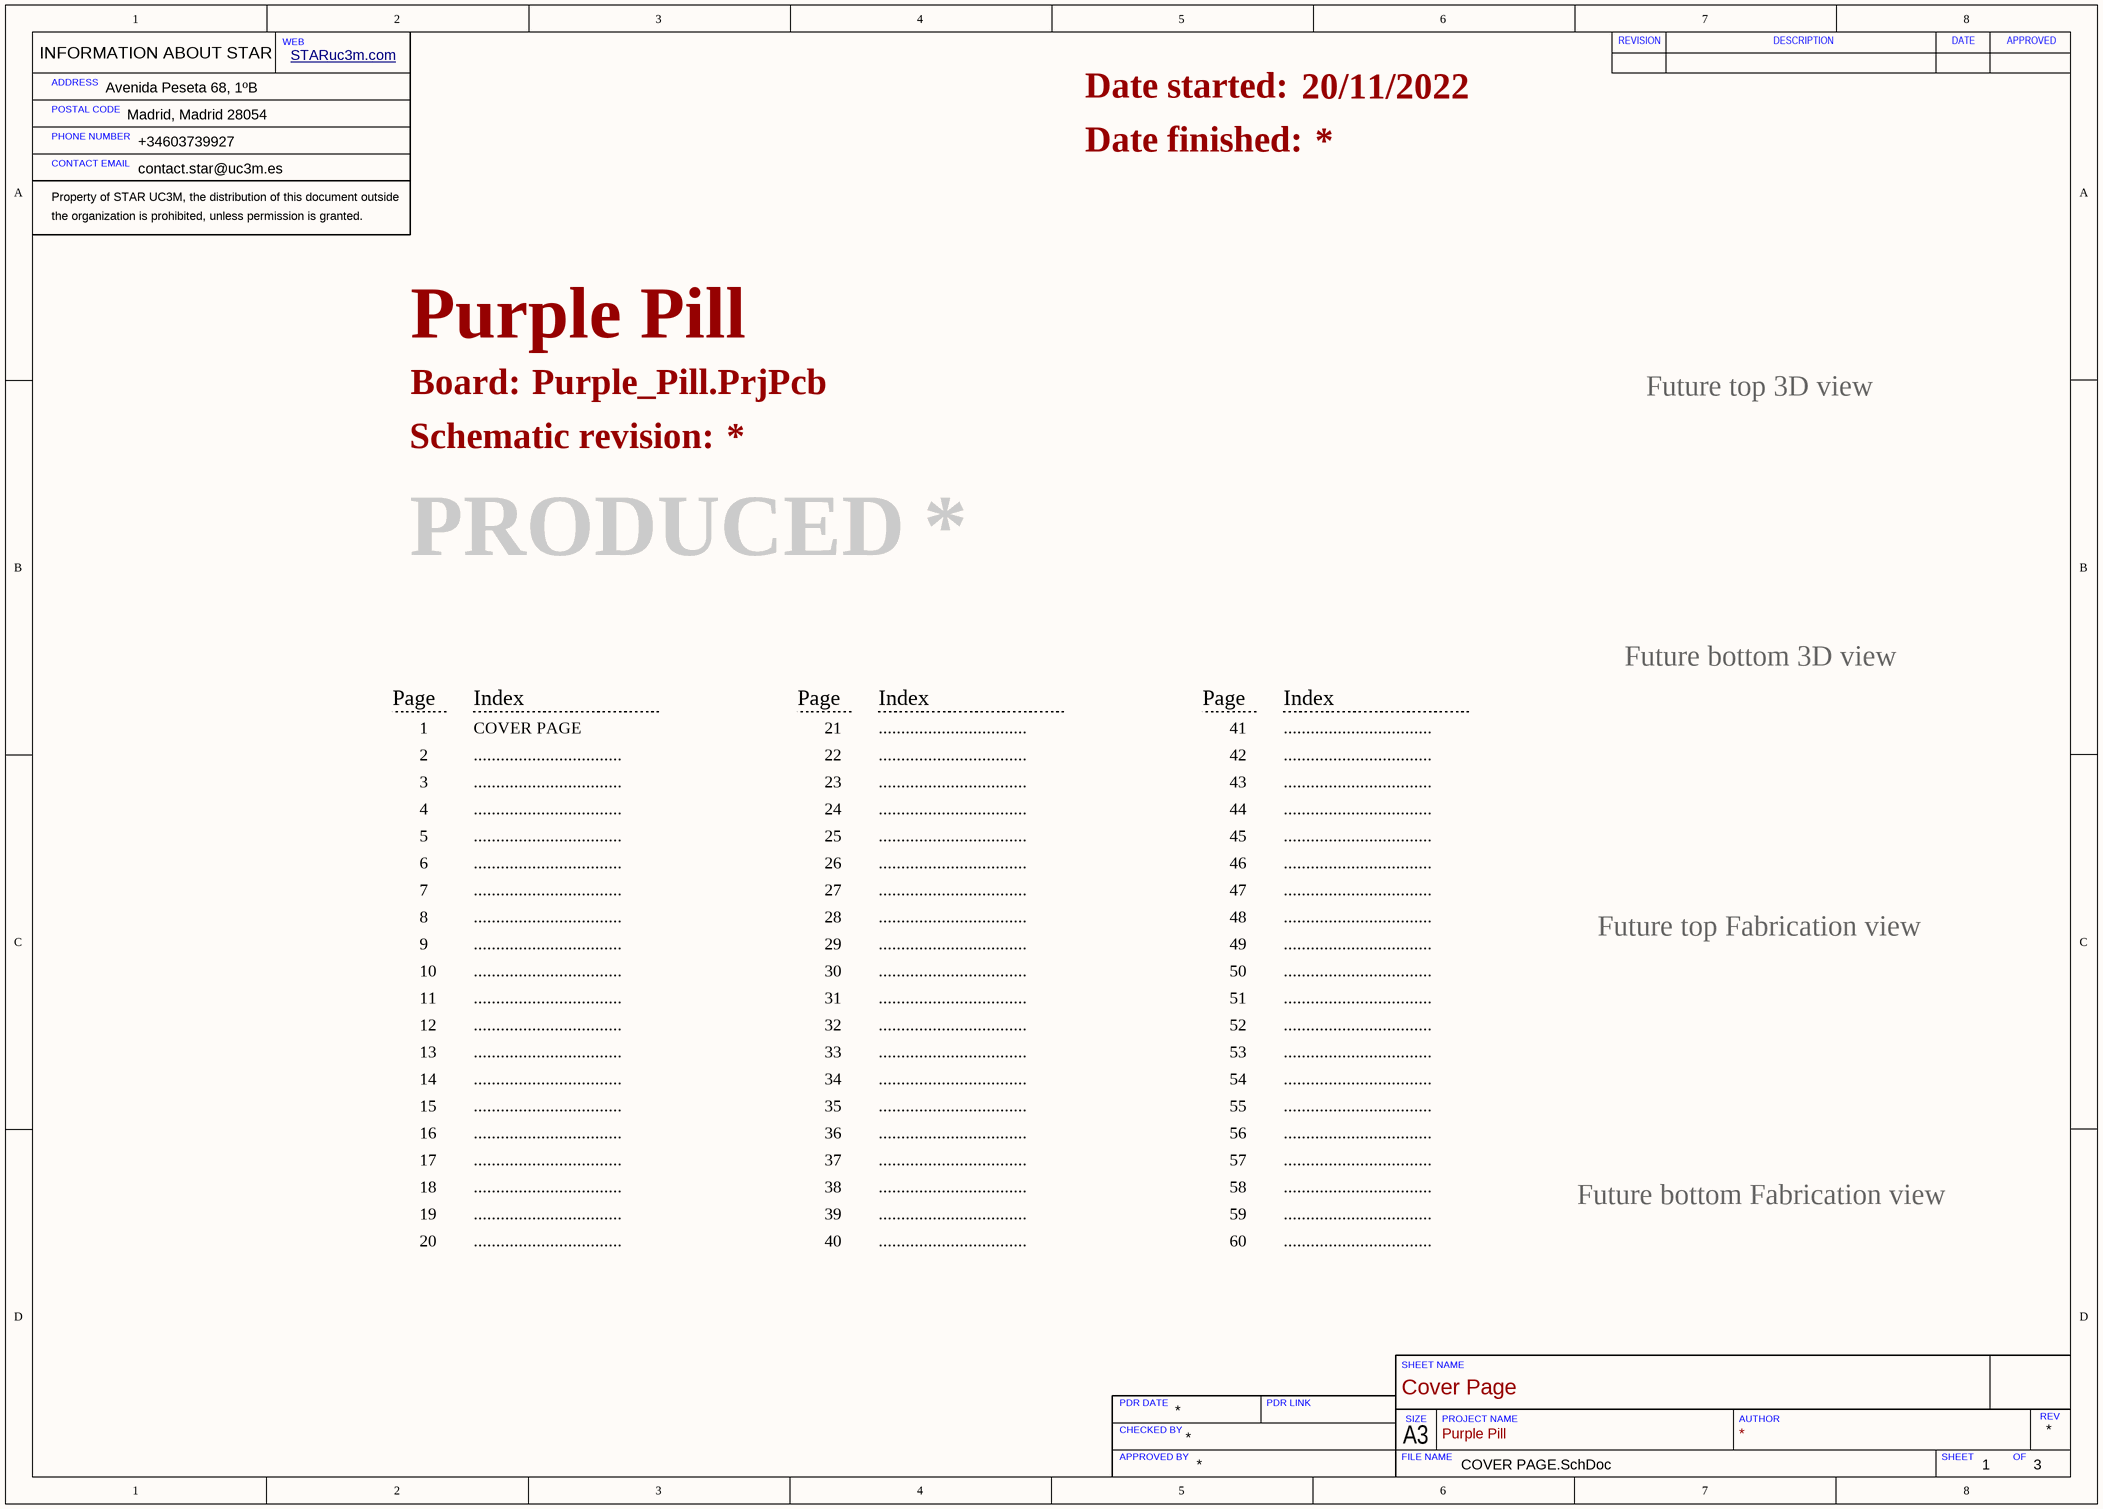
[diagram p3: COVER PAGE.SchDoc]

### Notes on the sheet
- Date started:
- Date finished:
- Schematic revision:
- Board:
- Future top 3D view
- PRODUCED
- Page
- Index
- Future bottom 3D view
- 1
- 2
- 3
- COVER PAGE
- .................................
- 21
- 22
- 23
- 41
- 42
- 43
- 4
- 5
- 24
- 25
- 44
- 45
- 6
- 7
- 8
- 26
- 27
- 28
- 46
- 47
- 48
- 9
- 10
- 29
- 30
- 49
- 50
- Future top Fabrication view
- 11
- 12
- 13
- 31
- 32
- 33
- 51
- 52
- 53
- 14
- 15
- 34
- 35
- 54
- 55
- 16
- 17
- 18
- 36
- 37
- 38
- 56
- 57
- 58
- 19
- 20
- 39
- 40
- 59
- 60
- Future bottom Fabrication view
- INFORMATION ABOUT STAR
- WEB
- REVISION
- DESCRIPTION
- DATE
- APPROVED
- ADDRESS
- POSTAL CODE
- PHONE NUMBER
- CONTACT EMAIL
- Property of STAR UC3M, the distribution of this document outside
- the organization is prohibited, unless permission is granted.
- PDR DATE
- PDR LINK
- SHEET NAME
- APPROVED BY
- CHECKED BY
- FILE NAME
- A3
- SIZE
- PROJECT NAME
- AUTHOR
- SHEET
- OF
- REV

## Nets that join several sheets
+3.3V: STM32_Controller (16 pins), Pinout (16 pins)
GND: STM32_Controller (30 pins), Pinout (23 pins)
VUSB: STM32_Controller (LED1.1 LED1.3 LED1.5), Pinout (6 pins)
NRST: STM32_Controller (C14.2 SW1.1 U1.7), Pinout (R23.1)
PA0: STM32_Controller (U1.14), Pinout (H1.24)
PA4: STM32_Controller (U1.20), Pinout (H2.21)
PA5: STM32_Controller (U1.21), Pinout (H1.21)
PA7: STM32_Controller (U1.23), Pinout (H1.23)
PA8: STM32_Controller (U1.41), Pinout (H1.8)
PB0: STM32_Controller (U1.26), Pinout (H2.19)
PB1: STM32_Controller (U1.27), Pinout (H2.18)
PB2: STM32_Controller (U1.28), Pinout (H2.17)
PB5: STM32_Controller (U1.57), Pinout (H1.16)
PB7: STM32_Controller (U1.59), Pinout (H1.10)
PB8: STM32_Controller (U1.61), Pinout (H1.11)
PB9: STM32_Controller (U1.62), Pinout (H2.14)
PB10: STM32_Controller (U1.29), Pinout (H2.13)
PB12: STM32_Controller (U1.33), Pinout (H2.12)
PB13: STM32_Controller (U1.34), Pinout (H2.11)
PB14: STM32_Controller (U1.35), Pinout (H2.10)
PC0: STM32_Controller (U1.8), Pinout (H1.17)
PC1: STM32_Controller (U1.9), Pinout (H1.18)
PC2: STM32_Controller (U1.10), Pinout (H1.19)
PC3: STM32_Controller (U1.11), Pinout (H1.20)
PC4: STM32_Controller (U1.24), Pinout (H2.20)
PC5: STM32_Controller (U1.25), Pinout (H1.2)
PC6: STM32_Controller (U1.37), Pinout (H2.7)
PC7: STM32_Controller (U1.38), Pinout (H2.8)
PC10: STM32_Controller (U1.51), Pinout (H1.3)
PC12: STM32_Controller (U1.53), Pinout (H1.5)
PC13: STM32_Controller (U1.2), Pinout (H1.14)
PC14: STM32_Controller (U1.4), Pinout (H1.12)
PC15: STM32_Controller (U1.3), Pinout (H1.13)
PD2: STM32_Controller (U1.54), Pinout (H1.9)
RGB_B: STM32_Controller (Q3.1 R7.2 U1.17), Pinout (H2.22)
RGB_G: STM32_Controller (Q2.1 R6.2 U1.16), Pinout (H2.23)
RGB_R: STM32_Controller (Q1.1 R5.2 U1.15), Pinout (H2.24)
SDIO_CMD: STM32_Controller (U1.22), Pinout (H1.22 R20.1 U2.3)
SDIO_D0: STM32_Controller (U1.39), Pinout (H2.6 R12.1 U2.7)
SDIO_D1: STM32_Controller (U1.40), Pinout (H2.5 R13.1 U2.8)
SDIO_D2: STM32_Controller (U1.42), Pinout (H2.4 R14.1 U2.1)
SDIO_D3: STM32_Controller (U1.52), Pinout (H1.4 R19.1 U2.2)
SDIO_SCK: STM32_Controller (U1.36), Pinout (H2.9 U2.5)
SWCLK: STM32_Controller (U1.49), Pinout (R21.1)
SWDIO: STM32_Controller (U1.46), Pinout (R18.1)
SWO: STM32_Controller (U1.55), Pinout (R22.1)
USB_D_N: STM32_Controller (U1.44), Pinout (TVS1.1 USB1.A7 USB1.B7)
USB_D_P: STM32_Controller (U1.45), Pinout (TVS1.3 USB1.A6 USB1.B6)
VCP_RX: STM32_Controller (U1.43), Pinout (H1.7 R25.1)
VCP_TX: STM32_Controller (U1.58), Pinout (H1.6 R24.1)